# Altium schematic sheet Buttons, LEDs and Connectors.SchDoc
size A4; SheetNumber: 2; SheetTotal: 3
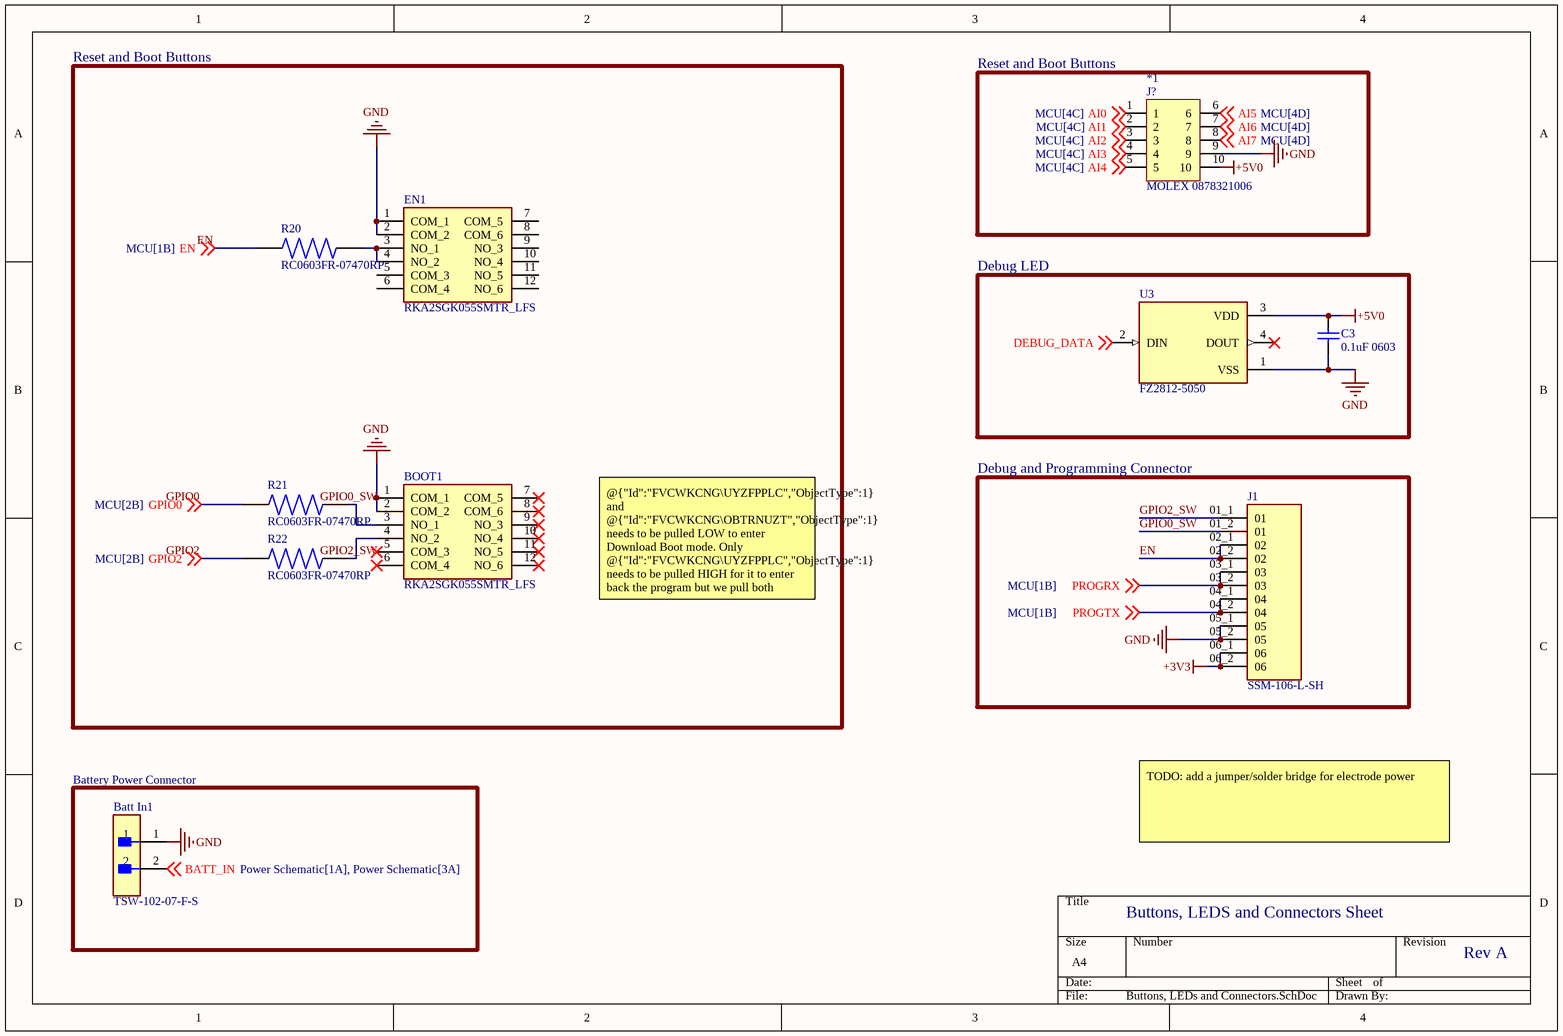
[diagram p0: Buttons, LEDs and Connectors.SchDoc]

## Parts
*1  MOLEX 0878321006  [MOLEX 0878321006]
Batt_In1  TSW-102-07-F-S  [FP-TSW-102-07-F-S-MFG]
BOOT1  RKA2SGK055SMTR_LFS  [RKA2SGK055SMTRLFS]
C3  0.1uF 0603  [CAPC1608X90X40LL10T20]
EN1  RKA2SGK055SMTR_LFS  [RKA2SGK055SMTRLFS]
J1  SSM-106-L-SH  [SAMTEC_SSM-106-L-SH]
R20  RC0603FR-07470RP  [RESC1608X55N]
R21  RC0603FR-07470RP  [RESC1608X55N]
R22  RC0603FR-07470RP  [RESC1608X55N]
U3  FZ2812-5050  [LED_FZ2812-5050]

## Blocks framed on the sheet
Reset and Boot Buttons: BOOT1 EN1 R20-R22
Reset and Boot Buttons: *1
Debug LED: C3 U3
Debug and Programming Connector: J1
Battery Power Connector: Batt_In1

## Nets
+3V3: J1.06_1(06) J1.06_2(06)
+5V0: *1.10 C3.2 U3.3(VDD)
GND: *1.9 Batt_In1.1 BOOT1.1(COM_1) BOOT1.2(COM_2) C3.1 EN1.1(COM_1) EN1.2(COM_2) J1.05_1(05) J1.05_2(05) U3.1(VSS)
AI0: *1.1 ; off-sheet AI0
AI1: *1.2 ; off-sheet AI1
AI2: *1.3 ; off-sheet AI2
AI3: *1.4 ; off-sheet AI3
AI4: *1.5 ; off-sheet AI4
AI5: *1.6 ; off-sheet AI5
AI6: *1.7 ; off-sheet AI6
AI7: *1.8 ; off-sheet AI7
BATT_IN: Batt_In1.2 ; off-sheet BATT_IN
DEBUG_DATA: U3.2(DIN) ; off-sheet DEBUG_DATA
EN: J1.02_1(02) J1.02_2(02) R20.2 ; off-sheet EN
GPIO0: R21.2 ; off-sheet GPIO0
GPIO0_SW: BOOT1.3(NO_1) J1.01_2(01) R21.1
GPIO2: R22.2 ; off-sheet GPIO2
GPIO2_SW: BOOT1.4(NO_2) J1.01_1(01) R22.1
PROGRX: J1.03_1(03) J1.03_2(03) ; off-sheet PROGRX
PROGTX: J1.04_1(04) J1.04_2(04) ; off-sheet PROGTX
NetEN1_3: EN1.3(NO_1) EN1.4(NO_2) R20.1

Not connected (* = marked no-connect by the designer): BOOT1 5(COM_3)* 6(COM_4)* 7(COM_5)* 8(COM_6)* 9(NO_3)* 10(NO_4)* 11(NO_5)* 12(NO_6)*; EN1 5(COM_3) 6(COM_4) 7(COM_5) 8(COM_6) 9(NO_3) 10(NO_4) 11(NO_5) 12(NO_6); U3 4(DOUT)*

## Notes on the sheet
- @{"Id":"FVCWKCNG\UYZFPPLC","ObjectType":1} and @{"Id":"FVCWKCNG\OBTRNUZT","ObjectType":1}
  needs to be pulled LOW to enter Download Boot mode. Only @{"Id":"FVCWKCNG\UYZFPPLC","ObjectType":1} needs to be pulled HIGH for it to enter back the program but we pull both @{"Id":"FVCWKCNG\UYZFPPLC","ObjectType":1} and @{"Id":"FVCWKCNG\OBTRNUZT","ObjectType":1} HIGH for simplicity
- TODO: add a jumper/solder bridge for electrode power
- Buttons, LEDS and Connectors Sheet
- Rev A
- (in symbol MOLEX 0878321006) J?

## Library data of the parts
Batt_In1 = CMP-02766-001458-1: CONN HEADER VERT 2POS 2.54MM; Gender: Male; Max Current Rating: 7.6A; Number of Contacts: 2; Max Voltage Rating (AC): 550V; Orientation: Straight; Depth: 2.54mm; Series: TSW; Package Quantity: 1; Min Operating Temperature: -55°C; Max Operating Temperature: 125°C; Contact Type: Male Pin; Contact Shape: Square; Color: Black; Housing Color: Black; Connector Type: Header; Fastening Type: Pull; Radiation Hardening: No; Pitch: 2.54mm; Housing Material: Polyester; Mount: Through Hole; Number of Positions: 2; Number of Rows: 1; Contact Material: Bronze; Insulation Color: Black; Contact Finish - Mating: GOLD; Termination: Solder; Insulation Material: PBT; Length: 5.08mm; Flammability Rating: UL94 V-0; Contact Mating Length: 0.23inch; REACH SVHC: No SVHC; Contact Plating: Gold; RoHS Compliant: Yes; Packaging: Bulk
BOOT1 EN1 = RKA2SGK055SMTR_LFS: Switch; Manufacturer_Name: C & K COMPONENTS; Manufacturer_Part_Number: RKA2SGK055SMTR LFS; Datasheet Link: https://www.ckswitches.com/media/3130/ck_rk_datasheet.pdf; Height: 0.55mm; Mouser Part Number: 611-RKA2SGK055SMTRLF; Mouser Price/Stock: https://www.mouser.co.uk/ProductDetail/CK/RKA2SGK055SMTR-LFS?qs=iLbezkQI%252BsiGAt%252Bzcl2zSQ%3D%3D; Arrow Part Number: RKA2SGK055SMTR LFS; Arrow Price/Stock: https://www.arrow.com/en/products/rka2sgk055smtr-lfs/ck?region=europe
C3 = CMP-1035-02594-2: Chip Capacitor, 100 nF, - 20% to + 80%, 50 V, -30 to 85 degC, 0603 (1608 Metric), RoHS, Tape and Reel; Manufacturer: Yageo; Tolerance: -20%,+80%; Capacitance: 0.1µF; Product Training Modules: MultilayerCeramicCapacitors; Temperature Coefficient: Y5V(F); Kits: CC060300000000000-ND-MLCC0603SAMPLEKIT; Other Names: 311-1343-1; Featured Product: CommodityMultilayerCeramicCapacitors–CCSeries; Online Catalog: CCSeries; Voltage - Rated: 50V; Mounting Type: SurfaceMount,MLCC; Package Description: 2-Pin Surface Mount Device, Body 1.6 x 0.8 mm; Ratings: -; Lead Spacing: -; Standard Package: 1; Applications: GeneralPurpose; Size / Dimension: 0.063"Lx0.031"W(1.60mmx0.80mm); Package Reference: 0603; Operating Temperature: -30°C~85°C; Features: -; Height - Seated (Max): -; Thickness (Max): 0.035"(0.90mm); Series: CC; Datasheet URL: https://datasheet.ciiva.com/17434/upy-gphc-y5v-6-3v-to-50v-5-17434523.pdf; Family: CeramicCapacitors; Mounting Technology: SurfaceMount; Packaging: CutTape(CT); Package / Case: 0603(1608Metric); Manufacturer URL: http://www.yageo.com/; Category: Capacitors; Lead Style: -; Datasheet Version: Rev. 5, 07/2010
J1 = SSM-106-L-SH: MF: {'manufacturer': u'Samtec'}; Package: None; Price: None; Value: *; MP: SSM-106-L-SH; Availability: Unavailable
R20-R22 = RC0603FR-07470RP: RES SMD 470 OHM 1% 1/10W 0603; MF: {'manufacturer': u'Yageo Corporation'}; Package: None; Price: None; Value: *; MP: RC0603FR-07470RP; Availability: Unavailable
U3 = FZ2812-5050: MF: {'manufacturer': u'Feztek'}; Package: None; Price: None; Value: *; MP: FZ2812-5050; Availability: Unavailable